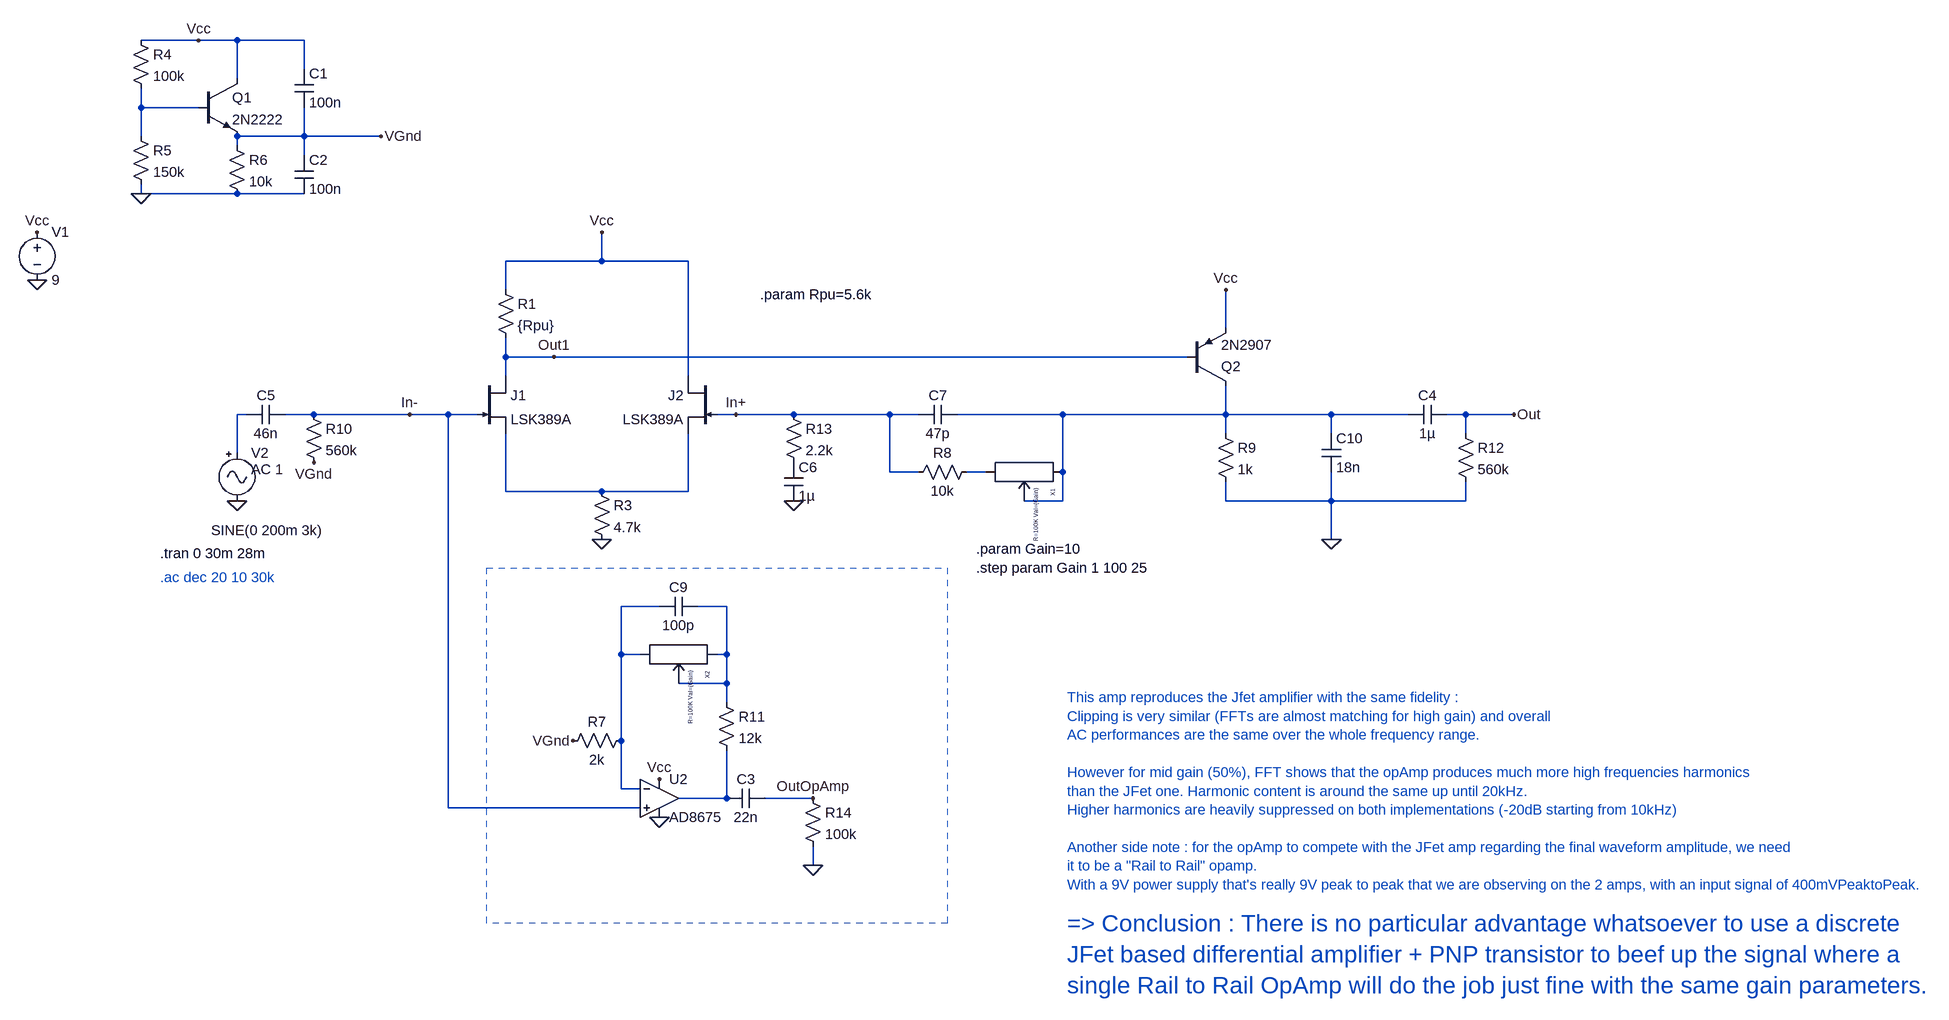
[diagram p0: schematic DifferentialJfetAmp.asc]
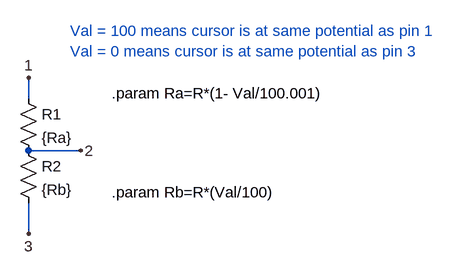
[diagram p1: sub-circuit potentiometer.asc]
DifferentialJfetAmp.asc, the LTspice schematic file:
Version 4
SHEET 1 2600 1232
WIRE -416 -480 -512 -480
WIRE -352 -480 -416 -480
WIRE -240 -480 -352 -480
WIRE -240 -432 -240 -480
WIRE -352 -416 -352 -480
WIRE -512 -368 -512 -400
WIRE -416 -368 -512 -368
WIRE -512 -320 -512 -368
WIRE -240 -320 -240 -368
WIRE -240 -320 -352 -320
WIRE -112 -320 -240 -320
WIRE -352 -304 -352 -320
WIRE -240 -288 -240 -320
WIRE -512 -224 -512 -240
WIRE -352 -224 -512 -224
WIRE -240 -224 -352 -224
WIRE 256 -112 256 -160
WIRE 256 -112 96 -112
WIRE 400 -112 256 -112
WIRE 96 -64 96 -112
WIRE 1296 0 1296 -64
WIRE 96 48 96 16
WIRE 176 48 96 48
WIRE 1232 48 176 48
WIRE 96 80 96 48
WIRE 400 80 400 -112
WIRE -336 144 -352 144
WIRE -224 144 -272 144
WIRE -64 144 -224 144
WIRE 0 144 -64 144
WIRE 48 144 0 144
WIRE 480 144 448 144
WIRE 576 144 480 144
WIRE 736 144 576 144
WIRE 784 144 736 144
WIRE 1024 144 848 144
WIRE 1296 144 1296 96
WIRE 1296 144 1024 144
WIRE 1472 144 1296 144
WIRE 1600 144 1472 144
WIRE 1696 144 1664 144
WIRE 1776 144 1696 144
WIRE 1296 176 1296 144
WIRE 1472 176 1472 144
WIRE 1696 176 1696 144
WIRE -352 208 -352 144
WIRE 736 240 736 144
WIRE 784 240 736 240
WIRE 896 240 864 240
WIRE 1024 240 1024 144
WIRE 96 272 96 176
WIRE 256 272 96 272
WIRE 400 272 400 176
WIRE 400 272 256 272
WIRE 1024 288 1024 240
WIRE 1024 288 960 288
WIRE 1296 288 1296 256
WIRE 1472 288 1472 240
WIRE 1472 288 1296 288
WIRE 1696 288 1696 256
WIRE 1696 288 1472 288
WIRE 1472 352 1472 288
WIRE 352 464 288 464
WIRE 464 464 416 464
WIRE 288 544 288 464
WIRE 320 544 288 544
WIRE 464 544 464 464
WIRE 464 544 448 544
WIRE 464 592 464 544
WIRE 464 592 384 592
WIRE 464 624 464 592
WIRE 288 688 288 544
WIRE 288 768 288 688
WIRE 320 768 288 768
WIRE 464 784 464 704
WIRE 464 784 384 784
WIRE 608 784 528 784
WIRE 0 800 0 144
WIRE 320 800 0 800
WIRE 608 896 608 864
FLAG -800 -80 0
FLAG 256 352 0
FLAG 480 144 In+
FLAG -64 144 In-
FLAG 176 48 Out1
FLAG -352 288 0
FLAG -512 -224 0
FLAG -112 -320 VGnd
FLAG 1776 144 Out
FLAG 576 288 0
FLAG -800 -160 Vcc
FLAG -224 224 VGnd
FLAG -416 -480 Vcc
FLAG 256 -160 Vcc
FLAG 1296 -64 Vcc
FLAG 352 816 0
FLAG 352 752 Vcc
FLAG 608 784 OutOpAmp
FLAG 608 896 0
FLAG 208 688 VGnd
FLAG 1472 352 0
SYMBOL njf 48 80 R0
SYMATTR InstName J1
SYMATTR Value LSK389A
SYMBOL njf 448 80 M0
SYMATTR InstName J2
SYMATTR Value LSK389A
SYMBOL res 80 -80 R0
SYMATTR InstName R1
SYMATTR Value {Rpu}
SYMBOL res 240 256 R0
SYMATTR InstName R3
SYMATTR Value 4.7k
SYMBOL voltage -800 -176 R0
WINDOW 123 0 0 Left 0
WINDOW 39 0 0 Left 0
SYMATTR InstName V1
SYMATTR Value 9
SYMBOL Misc\\signal -352 192 R0
WINDOW 3 -43 145 Left 2
WINDOW 123 24 44 Left 2
WINDOW 39 0 0 Left 0
SYMATTR Value SINE(0 200m 3k)
SYMATTR Value2 AC 1
SYMATTR InstName V2
SYMBOL res -528 -496 R0
SYMATTR InstName R4
SYMATTR Value 100k
SYMBOL res -528 -336 R0
SYMATTR InstName R5
SYMATTR Value 150k
SYMBOL npn -416 -416 R0
SYMATTR InstName Q1
SYMATTR Value 2N2222
SYMBOL res -368 -320 R0
SYMATTR InstName R6
SYMATTR Value 10k
SYMBOL cap -256 -432 R0
SYMATTR InstName C1
SYMATTR Value 100n
SYMBOL cap -256 -288 R0
SYMATTR InstName C2
SYMATTR Value 100n
SYMBOL pnp 1232 96 M180
SYMATTR InstName Q2
SYMATTR Value 2N2907
SYMBOL res 1280 160 R0
SYMATTR InstName R9
SYMATTR Value 1k
SYMBOL cap 1664 128 R90
WINDOW 0 0 32 VBottom 2
WINDOW 3 32 32 VTop 2
SYMATTR InstName C4
SYMATTR Value 1µ
SYMBOL res 1680 160 R0
SYMATTR InstName R12
SYMATTR Value 560k
SYMBOL res 560 128 R0
SYMATTR InstName R13
SYMATTR Value 2.2k
SYMBOL cap 560 224 R0
SYMATTR InstName C6
SYMATTR Value 1µ
SYMBOL cap 848 128 R90
WINDOW 0 0 32 VBottom 2
WINDOW 3 32 32 VTop 2
SYMATTR InstName C7
SYMATTR Value 47p
SYMBOL res 880 224 R90
WINDOW 0 0 56 VBottom 2
WINDOW 3 32 56 VTop 2
SYMATTR InstName R8
SYMATTR Value 10k
SYMBOL Potentiometer 960 240 R90
WINDOW 39 28 -21 Left 0
SYMATTR InstName X1
SYMATTR SpiceLine R=100K Val={Gain}
SYMBOL cap -272 128 R90
WINDOW 0 0 32 VBottom 2
WINDOW 3 32 32 VTop 2
SYMATTR InstName C5
SYMATTR Value 46n
SYMBOL res -240 128 R0
SYMATTR InstName R10
SYMATTR Value 560k
SYMBOL res 304 672 R90
WINDOW 0 0 56 VBottom 2
WINDOW 3 32 56 VTop 2
SYMATTR InstName R7
SYMATTR Value 2k
SYMBOL res 592 768 R0
SYMATTR InstName R14
SYMATTR Value 100k
SYMBOL cap 528 768 R90
WINDOW 0 0 32 VBottom 2
WINDOW 3 32 32 VTop 2
SYMATTR InstName C3
SYMATTR Value 22n
SYMBOL cap 416 448 R90
WINDOW 0 0 32 VBottom 2
WINDOW 3 32 32 VTop 2
SYMATTR InstName C9
SYMATTR Value 100p
SYMBOL Potentiometer 384 544 R90
WINDOW 39 28 -21 Left 0
SYMATTR InstName X2
SYMATTR SpiceLine R=100K Val={Gain}
SYMBOL res 448 608 R0
SYMATTR InstName R11
SYMATTR Value 12k
SYMBOL cap 1456 176 R0
SYMATTR InstName C10
SYMATTR Value 18n
SYMBOL OpAmps\\AD8675 352 720 R0
SYMATTR InstName U2
TEXT -480 376 Left 2 !.tran 0 30m 28m
TEXT 520 -56 Left 2 !.param Rpu=5.6k
TEXT -480 416 Left 2 ;.ac dec 20 10 30k
TEXT 880 368 Left 2 !.param Gain=10
TEXT 880 400 Left 2 !.step param Gain 1 100 25
TEXT 1032 616 Left 2 ;This amp reproduces the Jfet amplifier with the same fidelity : \nClipping is very similar (FFTs are almost matching for high gain) and overall\nAC performances are the same over the whole frequency range.\n \nHowever for mid gain (50%), FFT shows that the opAmp produces much more high frequencies harmonics\nthan the JFet one. Harmonic content is around the same up until 20kHz.\nHigher harmonics are heavily suppressed on both implementations (-20dB starting from 10kHz)\n \nAnother side note : for the opAmp to compete with the JFet amp regarding the final waveform amplitude, we need\nit to be a "Rail to Rail" opamp.\nWith a 9V power supply that's really 9V peak to peak that we are observing on the 2 amps, with an input signal of 400mVPeaktoPeak.
TEXT 1032 992 Left 4 ;=> Conclusion : There is no particular advantage whatsoever to use a discrete \nJFet based differential amplifier + PNP transistor to beef up the signal where a \nsingle Rail to Rail OpAmp will do the job just fine with the same gain parameters.
RECTANGLE Normal 832 992 64 400 2

potentiometer.asc, the sub-circuit schematic file:
Version 4
SHEET 1 908 680
WIRE 192 96 192 64
WIRE 272 176 192 176
WIRE 192 304 192 256
FLAG 192 64 1
FLAG 272 176 2
FLAG 192 304 3
SYMBOL res 176 80 R0
SYMATTR InstName R1
SYMATTR Value {Ra}
SYMBOL res 176 160 R0
SYMATTR InstName R2
SYMATTR Value {Rb}
TEXT 320 88 Left 2 !.param Ra=R*(1- Val/100.001)
TEXT 320 240 Left 2 !.param Rb=R*(Val/100)
TEXT 256 -8 Left 2 ;Val = 100 means cursor is at same potential as pin 1\nVal = 0 means cursor is at same potential as pin 3

The netlist it stands for:
* DifferentialJfetAmp.asc
J1 Out1 In- N005 LSK389A
J2 Vcc In+ N005 LSK389A
R1 Vcc Out1 {Rpu}
R3 N005 0 4.7k
V1 Vcc 0 9
V2 N002 0 SINE(0 200m 3k) AC 1
R4 Vcc N001 100k
R5 N001 0 150k
Q1 Vcc N001 VGnd 0 2N2222
R6 VGnd 0 10k
C1 Vcc VGnd 100n
C2 VGnd 0 100n
Q2 N003 Out1 Vcc 0 2N2907
R9 N003 0 1k
C4 Out N003 1µ
R12 Out 0 560k
R13 In+ P001 2.2k
C6 P001 0 1µ
C7 N003 In+ 47p
R8 N004 In+ 10k
XX1 N003 N003 N004 potentiometer params: R=100K Val={Gain}
C5 In- N002 46n
R10 In- VGnd 560k
R7 N006 VGnd 2k
R14 OutOpAmp 0 100k
C3 OutOpAmp N008 22n
C9 N007 N006 100p
XX2 N007 N007 N006 potentiometer params: R=100K Val={Gain}
R11 N007 N008 12k
C10 N003 0 18n
XU2 In- N006 Vcc 0 N008 AD8675  ; pins In+ In- V+ V- OUT

* block symbol definitions
.subckt potentiometer 1 2 3
R1 1 2 {Ra}
R2 2 3 {Rb}
.param Ra=R*(1- Val/100.001)
.param Rb=R*(Val/100)
* Val = 100 means cursor is at same potential as pin 1
* Val = 0 means cursor is at same potential as pin 3
.ends potentiometer

.model NPN NPN
.model PNP PNP
.lib standard.bjt
.model NJF NJF
.model PJF PJF
.lib standard.jft
.tran 0 30m 28m
.param Rpu=5.6k
* .ac dec 20 10 30k
.param Gain=10
.step param Gain 1 100 25
* This amp reproduces the Jfet amplifier with the same fidelity :
* Clipping is very similar (FFTs are almost matching for high gain) and overall
* AC performances are the same over the whole frequency range.
* However for mid gain (50%), FFT shows that the opAmp produces much more high frequencies harmonics
* than the JFet one. Harmonic content is around the same up until 20kHz.
* Higher harmonics are heavily suppressed on both implementations (-20dB starting from 10kHz)
* Another side note : for the opAmp to compete with the JFet amp regarding the final waveform amplitude, we need
* it to be a "Rail to Rail" opamp.
* With a 9V power supply that's really 9V peak to peak that we are observing on the 2 amps, with an input signal of 400mVPeaktoPeak.
* => Conclusion : There is no particular advantage whatsoever to use a discrete
* JFet based differential amplifier + PNP transistor to beef up the signal where a
* single Rail to Rail OpAmp will do the job just fine with the same gain parameters.
.backanno
.end